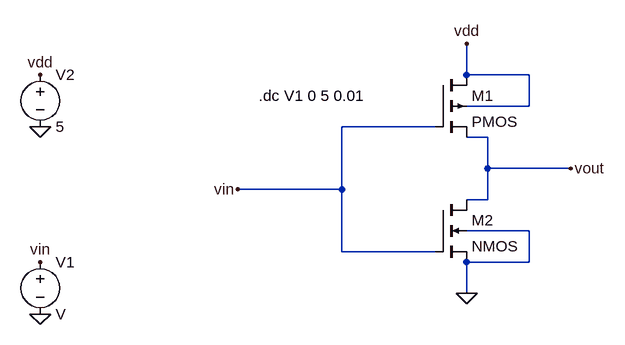
[diagram p0: schematic VTC of CMOS inverter.asc]
VTC of CMOS inverter.asc, the LTspice schematic file:
Version 4
SHEET 1 880 680
WIRE -192 64 -192 16
WIRE -96 64 -192 64
WIRE -96 112 -96 64
WIRE -96 112 -192 112
WIRE -240 144 -384 144
WIRE -160 160 -192 160
WIRE -160 208 -160 160
WIRE -32 208 -160 208
WIRE -384 240 -384 144
WIRE -384 240 -544 240
WIRE -160 256 -160 208
WIRE -160 256 -192 256
WIRE -96 304 -192 304
WIRE -384 336 -384 240
WIRE -240 336 -384 336
WIRE -96 352 -96 304
WIRE -96 352 -192 352
WIRE -192 400 -192 352
FLAG -544 240 vin
FLAG -192 16 vdd
FLAG -32 208 vout
FLAG -848 352 vin
FLAG -848 64 vdd
FLAG -848 144 0
FLAG -848 432 0
FLAG -192 400 0
SYMBOL pmos4 -240 64 R0
SYMATTR InstName M1
SYMBOL nmos4 -240 256 R0
SYMATTR InstName M2
SYMBOL voltage -848 336 R0
SYMATTR InstName V1
SYMBOL voltage -848 48 R0
WINDOW 123 0 0 Left 0
WINDOW 39 0 0 Left 0
SYMATTR InstName V2
SYMATTR Value 5
TEXT -512 96 Left 2 !.dc V1 0 5 0.01

The netlist it stands for:
* VTC of CMOS inverter.asc
M1 vdd vin vout vdd PMOS
M2 vout vin 0 0 NMOS
V1 vin 0 V
V2 vdd 0 5
.model NMOS NMOS
.model PMOS PMOS
.lib standard.mos
.dc V1 0 5 0.01
.backanno
.end